# Altium schematic sheet MesureAlimentation.SchDoc
size A3; Organization: Altium Limited; Address1: Laboratoire de Systèmes Embarqués; Address2: 7, rue de la Serre; Address3: 2610 Saint-Imier / Switzerland; PageSetup: Record=PageOptions|CenterHorizontal=True|CenterVertical=True|PrintScale=0.24|XCorrection=1.00|YCorrection=1.00|PrintKind=0|BorderSize=5000000|LeftOffset=0|BottomOffset=0|Orientation=2|PaperLength=1000|PaperWidth=1000|Scale=100|PaperSource=7|PrintQuality=-4|MediaType=1|DitherType=10|PaperKind=A4|PrintScaleMode=1
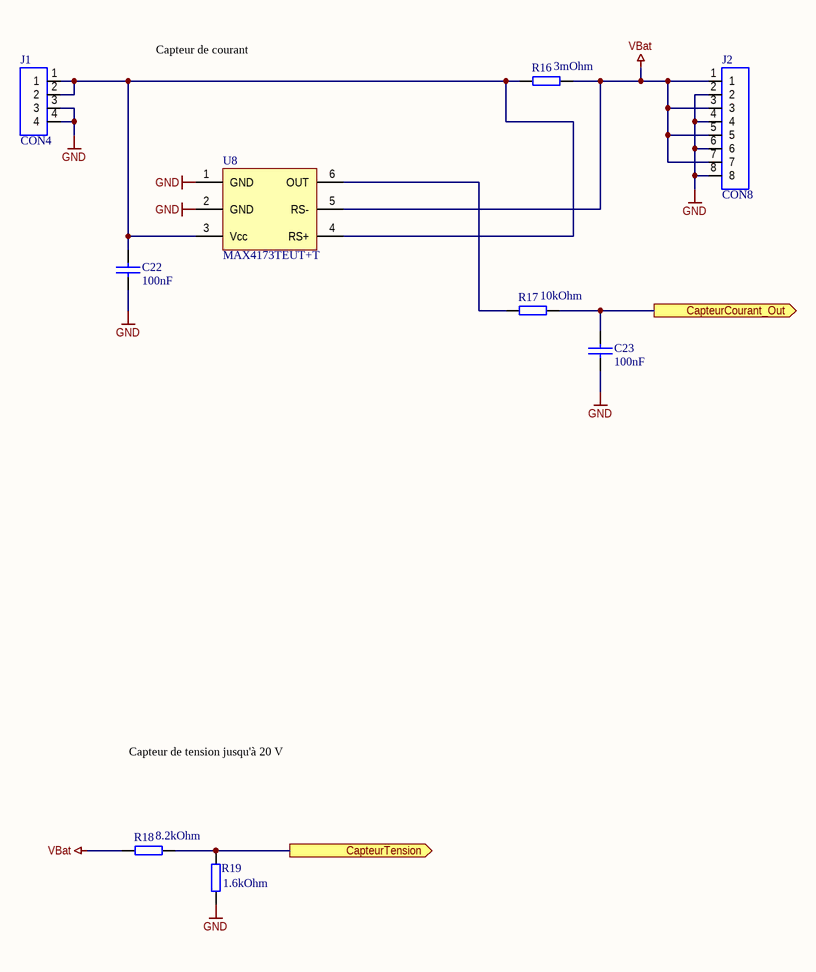
[diagram p0: MesureAlimentation.SchDoc]

## Parts
C22  value 100nF  [060301]  (hidden comment: GRM188R71E104KA01D)
C23  value 100nF  [060301]  (hidden comment: GRM188R71E104KA01D)
J1  CON4  [SL354D]
J2  CON8  [SL358D]
R16  value 3mOhm  [5.2x8.75]  (hidden comment: WSLP59313L000FEB)
R17  value 10kOhm  [080501]  (hidden comment: ERJ-6GEYJ103V)
R18  value 8.2kOhm  [080501]  (hidden comment: ERJ-6GEYJ822V)
R19  value 1.6kOhm  [080501]  (hidden comment: ERJ-6GEYJ162V)
U8  MAX4173TEUT+T  [SOT26A-6AM]

## Ports
CapteurCourant_Out (out), CapteurTension (out)

## Nets
GND: C22.2 C23.2 J1.3 J1.4 J2.2 J2.4 J2.6 J2.8 R19.2 U8.1(GND) U8.2(GND)
VBat: J2.1 J2.3 J2.5 J2.7 R16.2 R18.1 U8.5(RS-)
CapteurCourant_Out: C23.1 R17.2 ; port CapteurCourant_Out
CapteurTension: R18.2 R19.1 ; port CapteurTension
NetC22_1: C22.1 J1.1 J1.2 R16.1 U8.3(Vcc) U8.4(RS+)
NetR17_1: R17.1 U8.6(OUT)

## Notes on the sheet
- Capteur de courant
- Capteur de tension jusqu'à 20 V
- Title
- Size:
- Date:
- A3
- Author:
- Time:
- Revision:
- Sheet
- of
- File:

## Library data of the parts
C22 C23 = CAPA: EtatCommande: Interne; Text Field1: CAPA; Supplier 1: Digi-Key; Supplier Part Number 1: 490-1524-1-ND
J2 = CON8: Text Field1: CON; EtatCommande: Commandé; Supplier 1: Distrelec; Supplier Part Number 1: 141525
R16 = RES: Text Field1: RESISTANCE; EtatCommande: Commandé; Supplier 1: Digi-Key; Supplier Part Number 1: WSLPD-.003CT-ND
R17-R19 = RES: Text Field1: RESISTANCE; EtatCommande: Interne; Supplier 1: Digi-Key
  R17: Supplier Part Number 1: P10KACT-ND
  R18: Supplier Part Number 1: P8.2KACT-ND
  R19: Supplier Part Number 1: P1.6KACT-ND
U8 = Max4173: Amplificateur capteur de courant; EtatCommande: Commandé; Supplier 1: Digi-Key; Supplier Part Number 1: MAX4173TEUT+TCT-ND